# Altium schematic sheet Sheet1.SchDoc
size A4
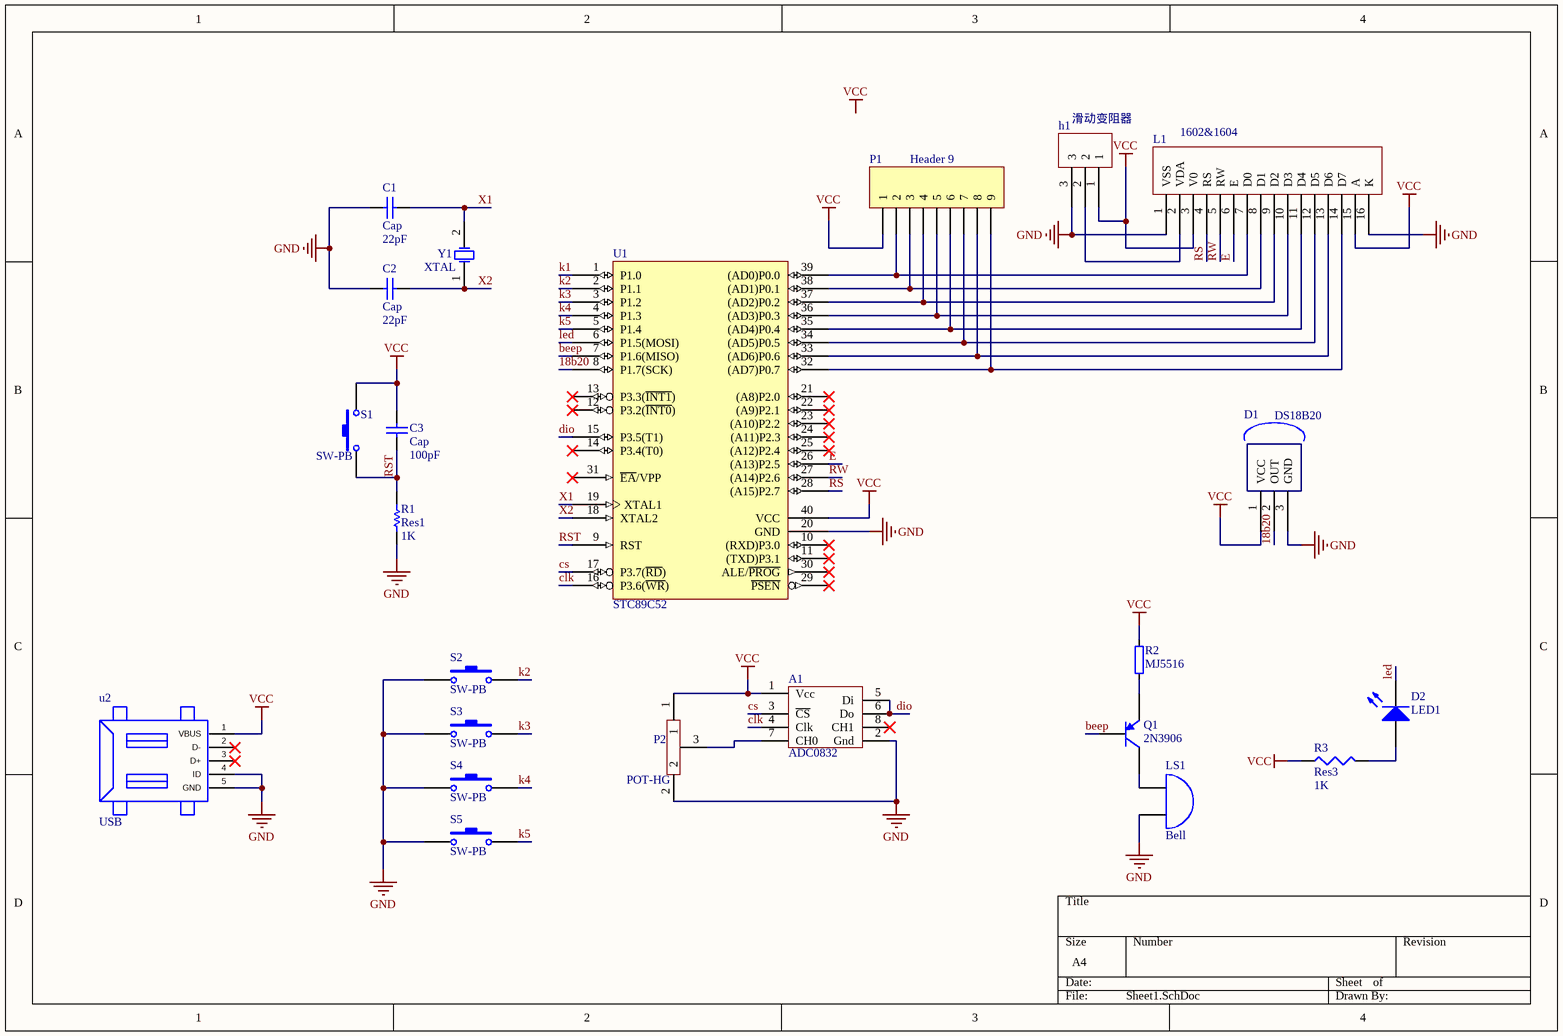
[diagram p0: Sheet1.SchDoc]

## Parts
A1  ADC0832
C1  Cap  value 22pF  [RAD-0.3]
C2  Cap  value 22pF  [RAD-0.3]
C3  Cap  value 100pF  [RAD-0.3]
D1  DS18B20
D2  LED1  [LED-1]
h1  滑动变阻器
L1  1602&1604
LS1  Bell  [PIN2]
P1  Header 9  [HDR1X9]
P2  POT-HG
Q1  2N3906  [TO-92A]
R1  Res1  value 1K  [AXIAL-0.3]
R2  MJ5516  [MJ5515]
R3  Res3  value 1K  [J1-0603]
S1  SW-PB  [SPST-2]
S2  SW-PB  [SPST-2]
S3  SW-PB  [SPST-2]
S4  SW-PB  [SPST-2]
S5  SW-PB  [SPST-2]
U1  STC89C52  [DIP-40]
u2  USB
Y1  XTAL  [R38]

## Nets
GND: A1.2(Gnd) C1.1 C2.1 D1.3(GND) h1.3 L1.1(VSS) L1.16(K) LS1.2(B) P2.2 R1.1 S2.1 S3.1 S4.1 S5.1 U1.20(GND) u2.4(ID) u2.5(GND)
VCC: A1.1(Vcc) C3.2 D1.1(VCC) h1.1 L1.3(V0) L1.15(A) P1.1 P2.1 R2.2 R3.1 S1.2 U1.40(VCC) u2.1(VBUS)
18b20: D1.2(OUT) U1.8(P1.7(SCK))
beep: Q1.2(B) U1.7(P1.6(MISO))
clk: A1.4(Clk) U1.16(P3.6(~{WR}))
cs: A1.3(~{CS}) U1.17(P3.7(~{RD}))
dio: A1.5(Di) A1.6(Do) U1.15(P3.5(T1))
E: L1.6(E) U1.26((A13)P2.5)
k1: U1.1(P1.0)
k2: S2.2 U1.2(P1.1)
k3: S3.2 U1.3(P1.2)
k4: S4.2 U1.4(P1.3)
k5: S5.2 U1.5(P1.4)
led: D2.2(K) U1.6(P1.5(MOSI))
RS: L1.4(RS) U1.28((A15)P2.7)
RST: C3.1 R1.2 S1.1 U1.9(RST)
RW: L1.5(RW) U1.27((A14)P2.6)
X1: C1.2 U1.19(XTAL1) Y1.2(OSC2)
X2: C2.2 U1.18(XTAL2) Y1.1(OSC1)
NetA1_7: A1.7(CH0) P2.3
NetD2_1: D2.1(A) R3.2
Neth1_2: h1.2 L1.2(VDA)
NetL1_7: L1.7(D0) P1.2 U1.39((AD0)P0.0)
NetL1_8: L1.8(D1) P1.3 U1.38((AD1)P0.1)
NetL1_9: L1.9(D2) P1.4 U1.37((AD2)P0.2)
NetL1_10: L1.10(D3) P1.5 U1.36((AD3)P0.3)
NetL1_11: L1.11(D4) P1.6 U1.35((AD4)P0.4)
NetL1_12: L1.12(D5) P1.7 U1.34((AD5)P0.5)
NetL1_13: L1.13(D6) P1.8 U1.33((AD6)P0.6)
NetL1_14: L1.14(D7) P1.9 U1.32((AD7)P0.7)
NetLS1_1: LS1.1(A) Q1.3(C)
NetQ1_1: Q1.1(E) R2.1

Not connected (* = marked no-connect by the designer): A1 8(CH1)*; U1 10((RXD)P3.0)* 11((TXD)P3.1)* 12(P3.2(~{INT0}))* 13(P3.3(~{INT1}))* 14(P3.4(T0))* 21((A8)P2.0)* 22((A9)P2.1)* 23((A10)P2.2)* 24((A11)P2.3)* 25((A12)P2.4)* 29(~{PSEN})* 30(ALE/~{PROG})* 31(~{EA}/VPP)*; u2 2(D-)* 3(D+)*

## Notes on the sheet
- Labels drawn without touching a wire or pin: VCC

## Library data of the parts
C1-C3 = Cap: Capacitor; Published: 8-Jun-2000; LatestRevisionDate: 17-Jul-2002; LatestRevisionNote: Re-released for DXP Platform.; PackageReference: RAD-0.3; Publisher: Altium Limited; PackageDescription: Radial Cap, Thru-Hole; 2 Leads; 0.3 in Pin Spacing
D2 = LED1: Typical RED GaAs LED; Published: 8-Jun-2000; LatestRevisionDate: 08-Jul-2005; LatestRevisionNote: Mech Layer 1 removed.; PackageReference: LED-1; Publisher: Altium Limited; PackageDescription: LED; 2 Leads
LS1 = Bell: Electrical Bell; Published: 24-Mar-1999; LatestRevisionDate: 17-Jul-2002; LatestRevisionNote: Re-released for DXP Platform.; PackageReference: PIN2; Publisher: Altium Limited
P1 = Header 9: Header, 9-Pin; LatestRevisionDate: 17-Jul-2002; LatestRevisionNote: Re-released for DXP Platform.; Publisher: Altium Limited
Q1 = 2N3906: PNP General Purpose Amplifier; Published: 8-Jun-2000; LatestRevisionDate: 15-Jan-2003; LatestRevisionNote: PCB Footprint 'BCY-W3/D4.7' replaced; DatasheetVersion: 1997; PackageVersion: Sep-1998; PackageReference: TO-92A; Publisher: Altium Limited; PackageDescription: TO, Flat Index; 3 In-Line, Axial Leads; Body Dia. 4.5mm; Leads 0.51 x 0.48 mm (max); ComponentLink1Description: Manufacturer Link; ComponentLink1URL: http://www.fairchildsemi.com/; ComponentLink2Description: Datasheet; ComponentLink2URL: http://www.fairchildsemi.com/ds/2N%2F2N3906.pdf
R1 = Res1: Resistor; Published: 8-Jun-2000; LatestRevisionDate: 17-Jul-2002; LatestRevisionNote: Re-released for DXP Platform.; PackageReference: AXIAL-0.3; Publisher: Altium Limited; PackageDescription: Axial Device, Thru-Hole; 2 Leads; 0.3 in Pin Spacing
R2 = MJ5516: CR-MJ5516
R3 = Res3: Resistor; Published: 8-Jun-2000; LatestRevisionDate: 29-May-2009; LatestRevisionNote: IPC-7351 Footprint Added.; PackageReference: J1-0603; Publisher: Altium Limited; PackageDescription: Chip Resistor
S1-S5 = SW-PB: Switch; Published: 24-Mar-1999; LatestRevisionDate: 17-Jul-2002; LatestRevisionNote: Re-released for DXP Platform.; PackageReference: SPST-2; Publisher: Altium Limited
  S1: PackageDescription: Switch; 2 Leads
U1 = AT89S51: 8-Bit Microcontroller with 4K ISP Flash ROM
Y1 = XTAL: Crystal Oscillator; Published: 8-Jun-2000; LatestRevisionDate: 17-Jul-2002; LatestRevisionNote: Re-released for DXP Platform.; PackageReference: R38; Publisher: Altium Limited; PackageDescription: Crystal, Thru-Hole; 2 Leads; Body 3.1 x 8.2 mm (Dia.xH)